# EAGLE design CFT-PB02 (EAGLE 5.11)
DRAWN_BY: Alexios; PROJECT_NAME: CFT Mini-Computer; REVISION: Rev F; SHEET_DESCRIPTION: Microcode Banking; SIMULATION_FILENAME: N/A; URL: http://www.bedroomlan.org/cft

## Sheet 1 of 4
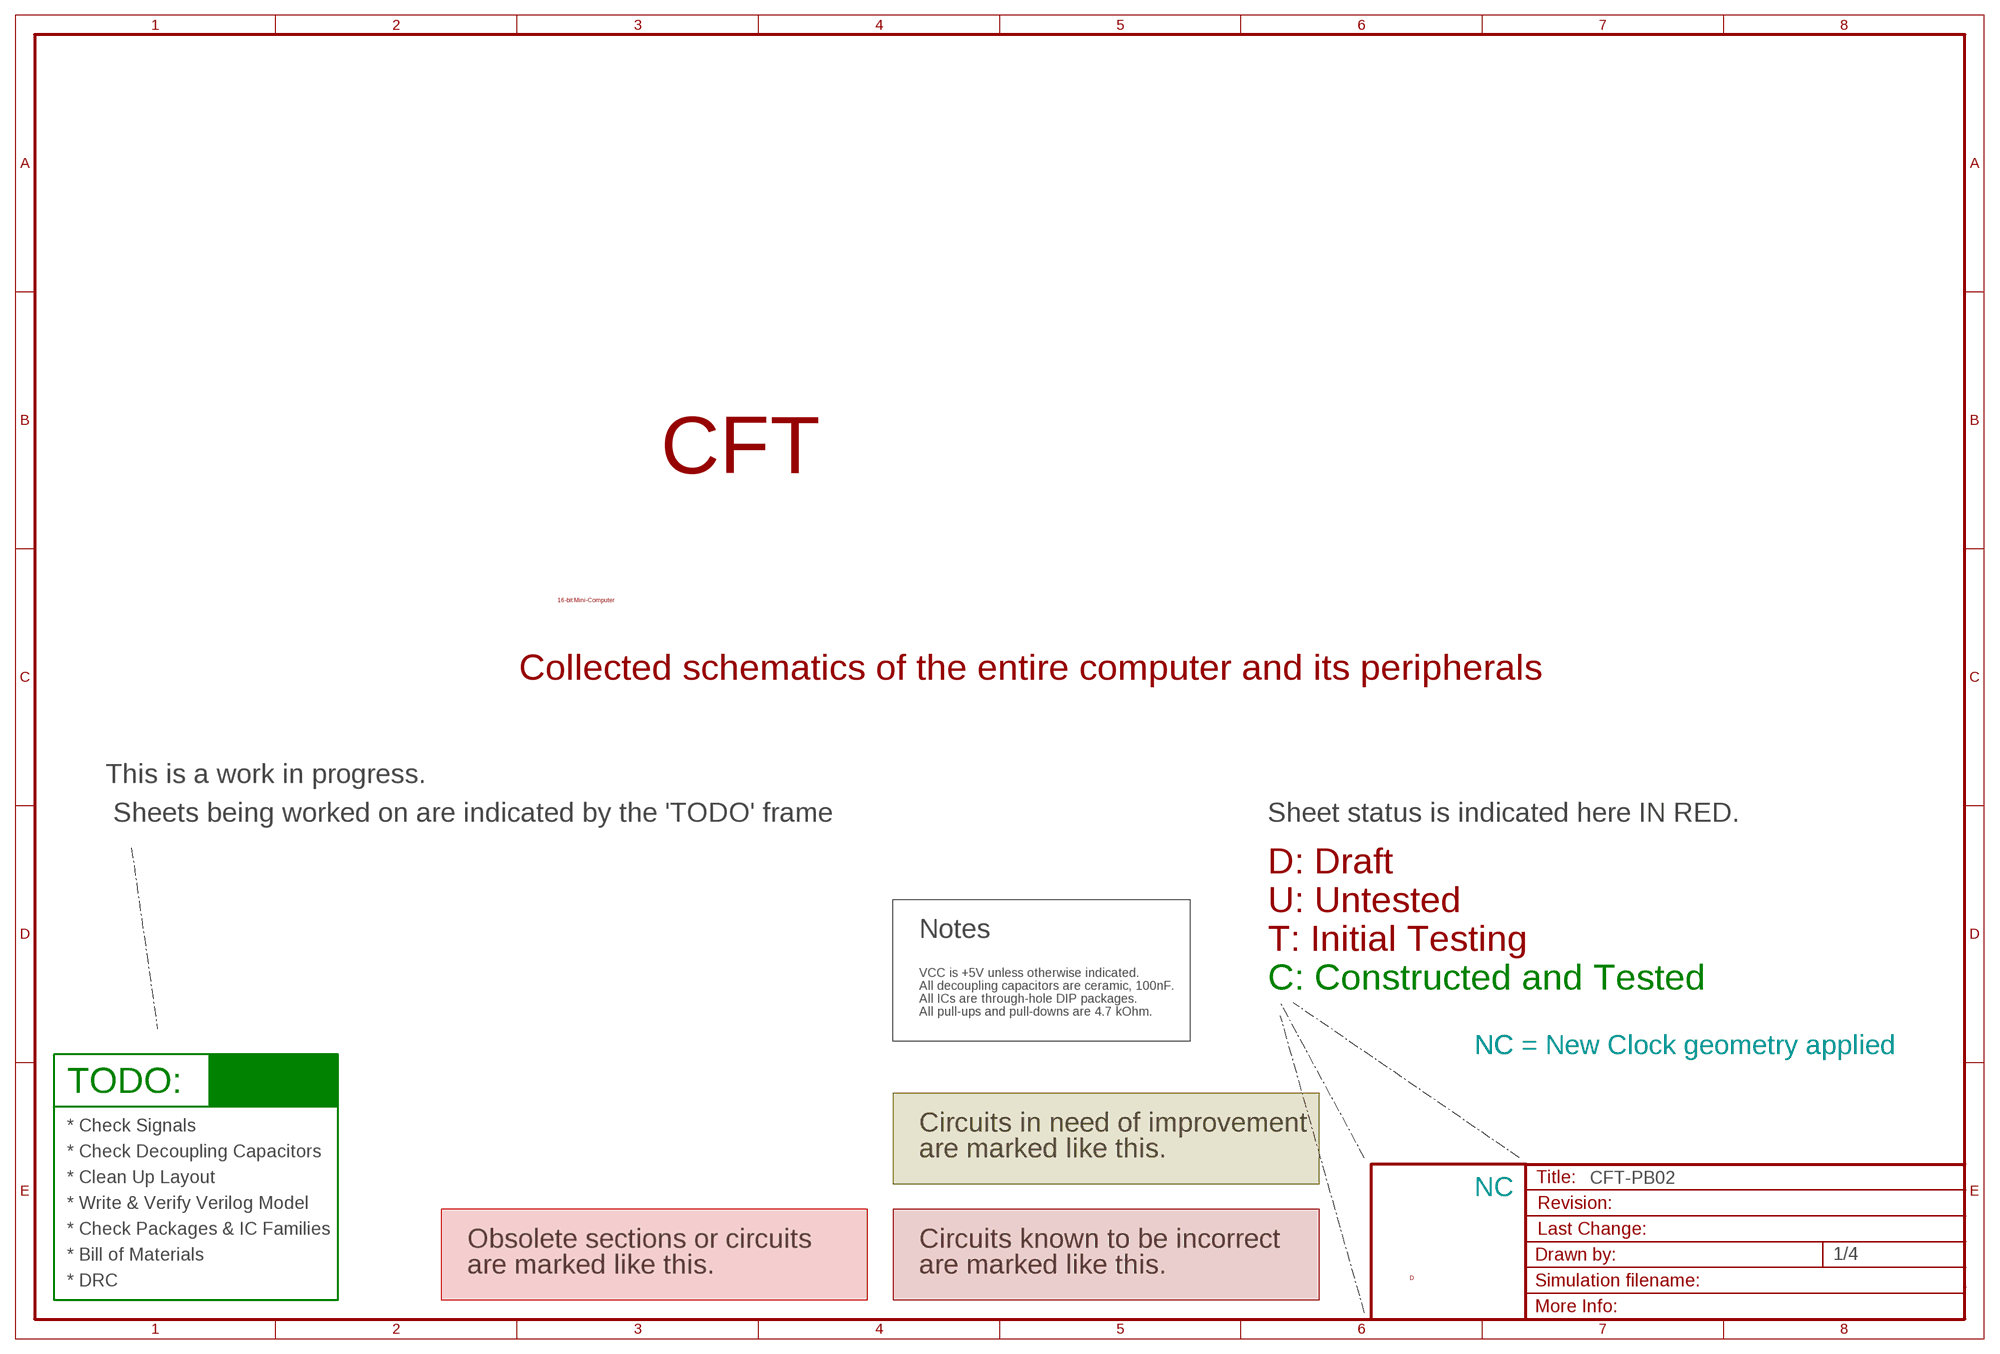
[diagram p0: schematic, sheet 1]

### Notes on the sheet
- CFT
- 16-bit Mini-Computer
- Collected schematics of the entire computer and its peripherals
- This is a work in progress.
- Sheets being worked on are indicated by the 'TODO' frame | Sheet status is indicated here IN RED.
- D: Draft
- U: Untested
- Notes
- T: Initial Testing
- VCC is +5V unless otherwise indicated.
- All decoupling capacitors are ceramic, 100nF. | C: Constructed and Tested
- All ICs are through-hole DIP packages.
- All pull-ups and pull-downs are 4.7 kOhm.
- NC | NC = New Clock geometry applied
- TODO:
- * Check Signals | Circuits in need of improvement
- * Check Decoupling Capacitors | are marked like this.
- * Clean Up Layout
- NC
- * Write & Verify Verilog Model
- * Check Packages & IC Families
- Obsolete sections or circuits | Circuits known to be incorrect
- * Bill of Materials
- are marked like this. | are marked like this.
- D
- * DRC

## Sheet 2 of 4
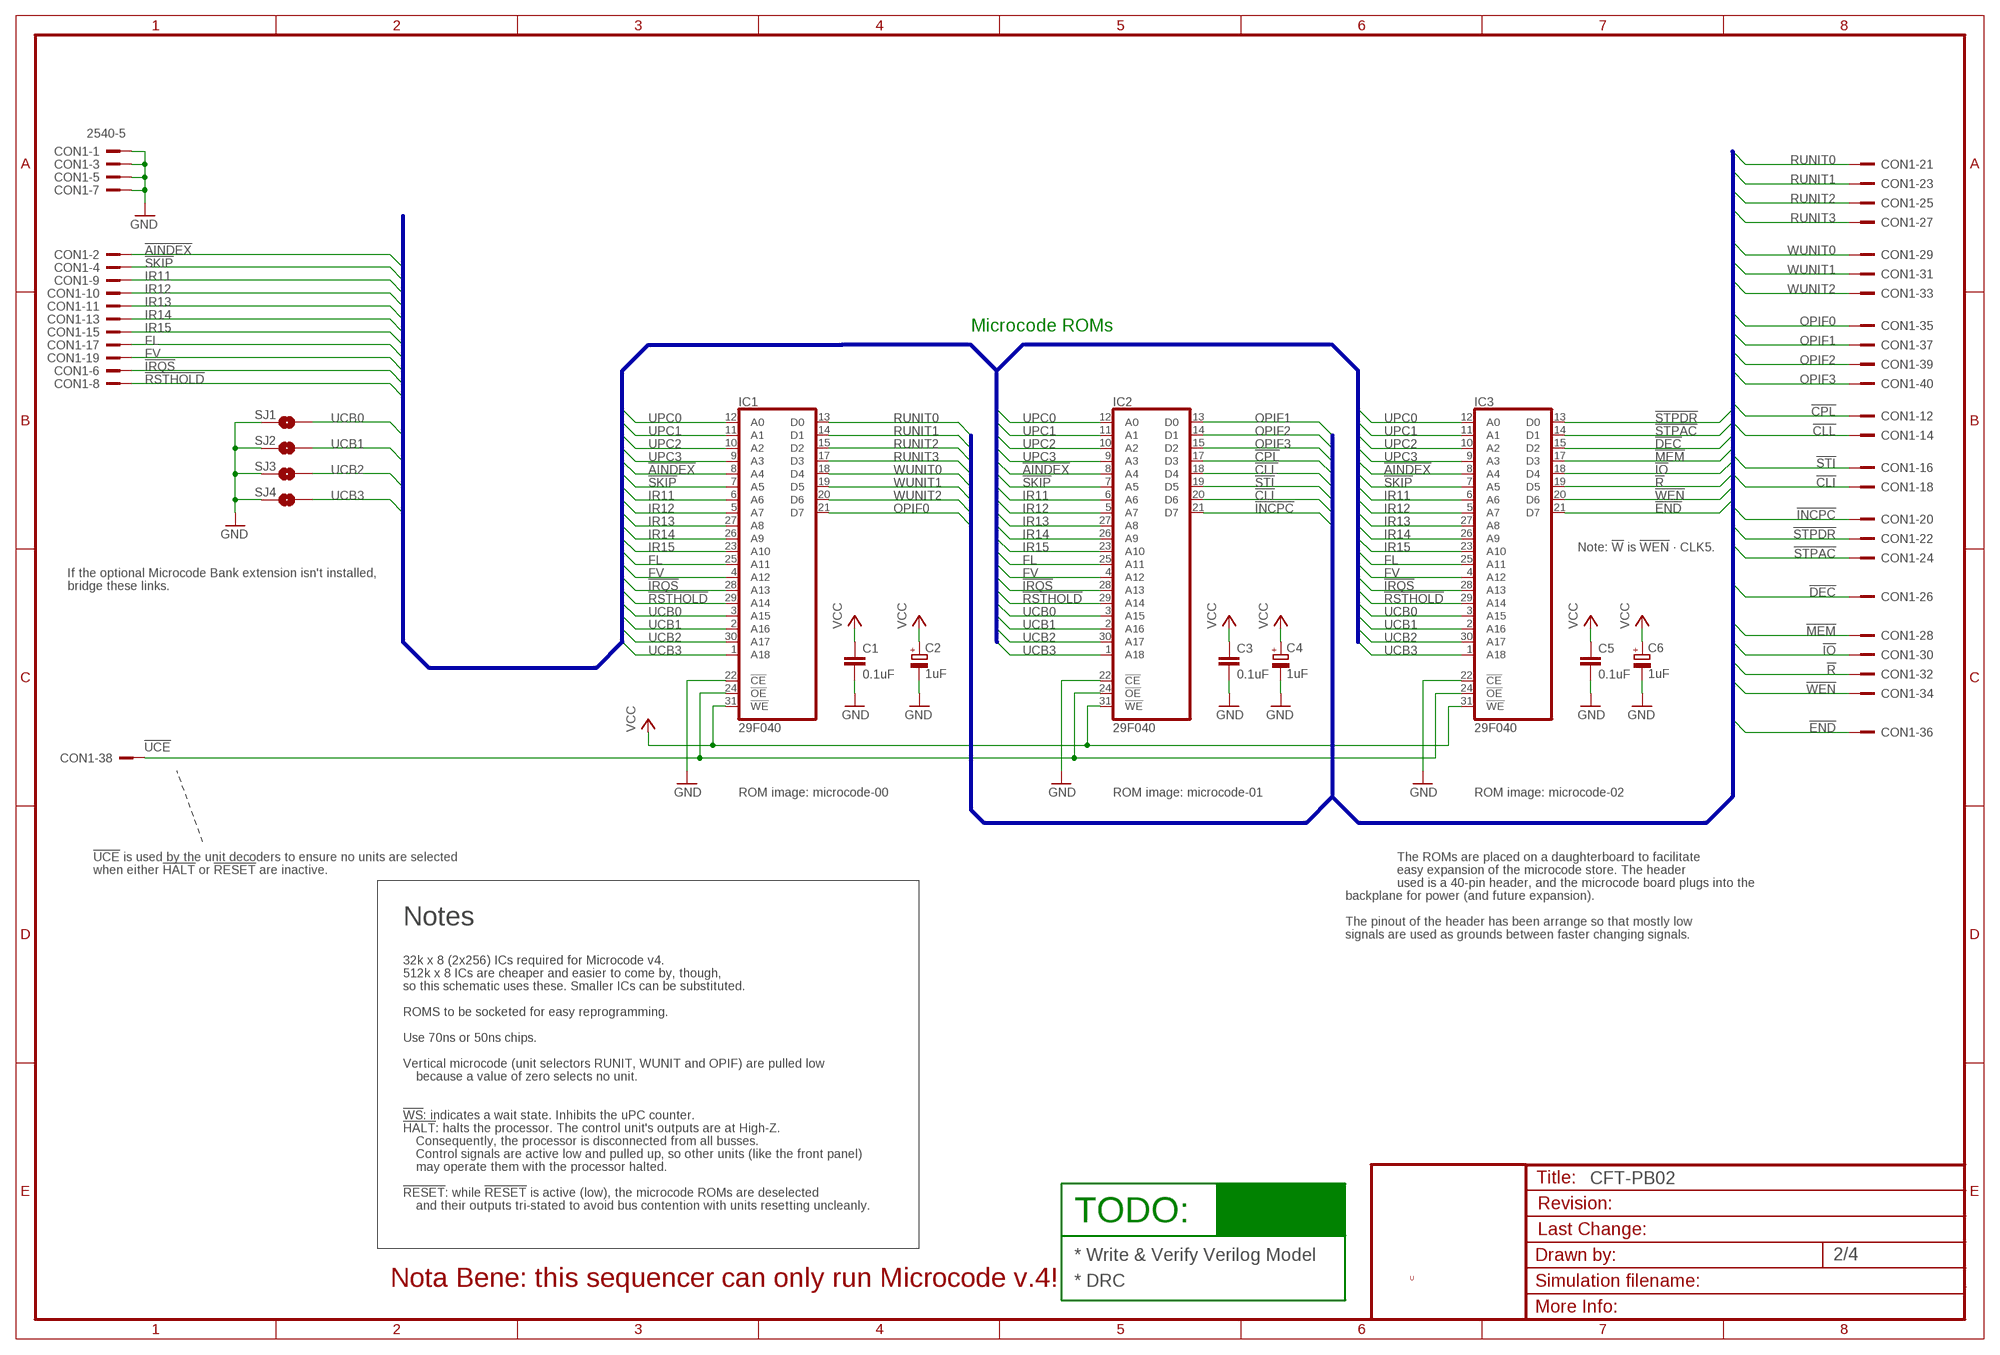
[diagram p1: schematic, sheet 2, part 1 of 2]
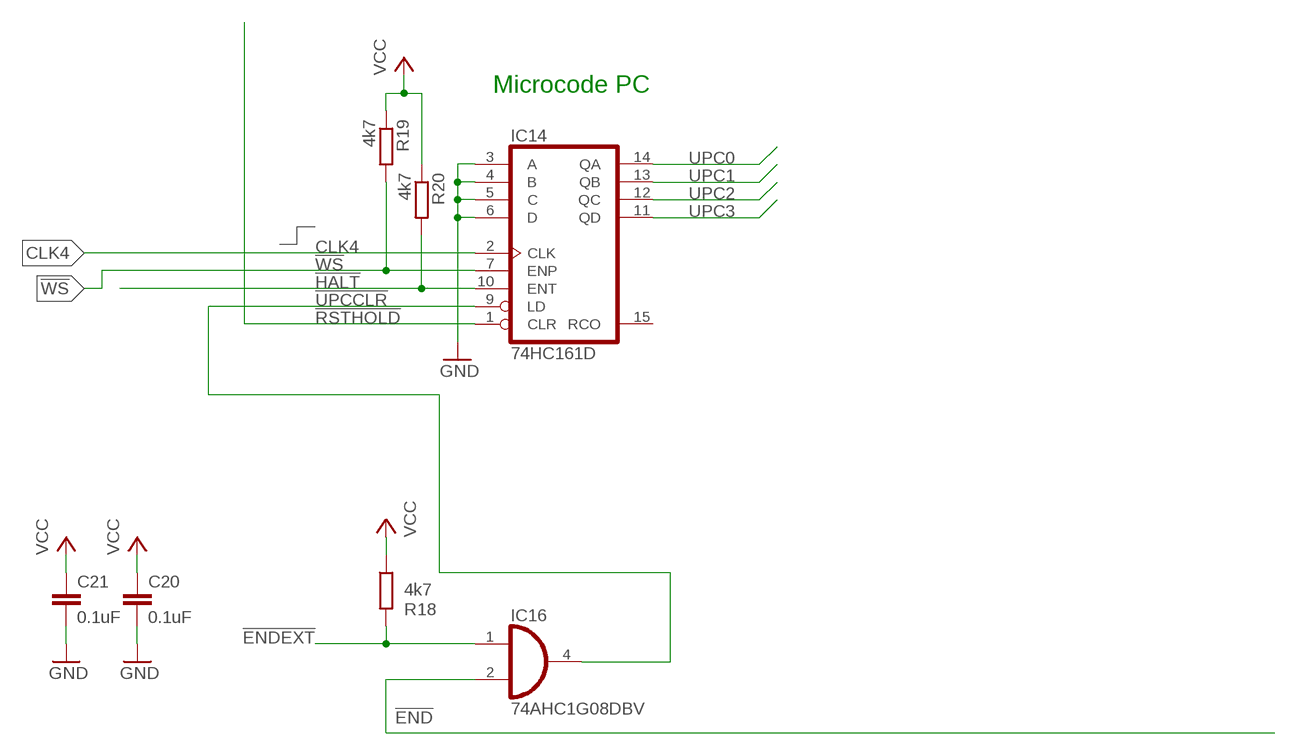
[diagram p2: schematic, sheet 2, part 2 of 2]

### Parts
C1  0.1uF  C-EUC0805K  [C0805K]
C2  1uF  CPOL-EUE2.5-5  [E2,5-5]
C3  0.1uF  C-EUC0805K  [C0805K]
C4  1uF  CPOL-EUE2.5-5  [E2,5-5]
C5  0.1uF  C-EUC0805K  [C0805K]
C6  1uF  CPOL-EUE2.5-5  [E2,5-5]
C20  0.1uF  C-EUC0805K  [C0805K]
C21  0.1uF  C-EUC0805K  [C0805K]
CON1  2540-5  [PAK100/2500-5-40]
IC1  29F040  29F040PLCC32  [PLCC32]
IC2  29F040  29F040PLCC32  [PLCC32]
IC3  29F040  29F040PLCC32  [PLCC32]
IC14  74HC161D  [SO16D]
IC16  74AHC1G08DBV  [SOT23-5]
R18  4k7  R-EU_R0805W  [R0805W]
R19  4k7  R-EU_R0805W  [R0805W]
R20  4k7  R-EU_R0805W  [R0805W]
SJ1  SOLDERJUMPER-OLDNO  [SJ_2S-NO]
SJ2  SOLDERJUMPER-OLDNO  [SJ_2S-NO]
SJ3  SOLDERJUMPER-OLDNO  [SJ_2S-NO]
SJ4  SOLDERJUMPER-OLDNO  [SJ_2S-NO]

### Nets
!AINDEX: CON1.2 IC1.8(A4) IC2.8(A4) IC3.8(A4)
!CLI: CON1.18 IC2.20(D6)
!CLL: CON1.14 IC2.18(D4)
!CPL: CON1.12 IC2.17(D3)
!DEC: CON1.26 IC3.15(D2)
!END: CON1.36 IC3.21(D7) IC16.2(I1) ; also sheet 3
!ENDEXT: IC16.1(I0) R18.2 ; also sheet 4
!HALT: IC14.10(ENT) R20.2 ; also sheet 4
!INCPC: CON1.20 IC2.21(D7)
!IO: CON1.30 IC3.18(D4) ; also sheet 4
!IRQS: CON1.6 IC1.28(A13) IC2.28(A13) IC3.28(A13) ; also sheet 4
!MEM: CON1.28 IC3.17(D3) ; also sheet 4
!R: CON1.32 IC3.19(D5) ; also sheet 4
!RSTHOLD: CON1.8 IC1.29(A14) IC2.29(A14) IC3.29(A14) IC14.1(CLR)
!SKIP: CON1.4 IC1.7(A5) IC2.7(A5) IC3.7(A5)
!STI: CON1.16 IC2.19(D5)
!STPAC: CON1.24 IC3.14(D1)
!STPDR: CON1.22 IC3.13(D0)
!UCE: CON1.38 IC1.24(!OE) IC2.24(!OE) IC3.24(!OE)
!UPCCLR: IC14.9(LD) IC16.4(O)
!WEN: CON1.34 IC3.20(D6)
!WS: IC14.7(ENP) R19.2 ; also sheet 4
CLK4: IC14.2(CLK) ; also sheet 4
FL: CON1.17 IC1.25(A11) IC2.25(A11) IC3.25(A11)
FV: CON1.19 IC1.4(A12) IC2.4(A12) IC3.4(A12)
GND [low power]: C1.2 C2.- C3.2 C4.- C5.2 C6.- C20.2 C21.2 CON1.1 CON1.3 CON1.5 CON1.7 IC1.22(!CE) IC2.22(!CE) IC3.22(!CE) IC14.3(A) IC14.4(B) IC14.5(C) IC14.6(D) SJ1.1 SJ2.1 SJ3.1 SJ4.1 ; also sheet 3,4
IR11: CON1.9 IC1.6(A6) IC2.6(A6) IC3.6(A6)
IR12: CON1.10 IC1.5(A7) IC2.5(A7) IC3.5(A7)
IR13: CON1.11 IC1.27(A8) IC2.27(A8) IC3.27(A8)
IR14: CON1.13 IC1.26(A9) IC2.26(A9) IC3.26(A9)
IR15: CON1.15 IC1.23(A10) IC2.23(A10) IC3.23(A10)
OPIF0: CON1.35 IC1.21(D7)
OPIF1: CON1.37 IC2.13(D0)
OPIF2: CON1.39 IC2.14(D1)
OPIF3: CON1.40 IC2.15(D2)
RUNIT0: CON1.21 IC1.13(D0)
RUNIT1: CON1.23 IC1.14(D1)
RUNIT2: CON1.25 IC1.15(D2)
RUNIT3: CON1.27 IC1.17(D3)
UCB0: IC1.3(A15) IC2.3(A15) IC3.3(A15) SJ1.2 ; also sheet 3
UCB1: IC1.2(A16) IC2.2(A16) IC3.2(A16) SJ2.2 ; also sheet 3
UCB2: IC1.30(A17) IC2.30(A17) IC3.30(A17) SJ3.2 ; also sheet 3
UCB3: IC1.1(A18) IC2.1(A18) IC3.1(A18) SJ4.2 ; also sheet 3
UPC0: IC1.12(A0) IC2.12(A0) IC3.12(A0) IC14.14(QA)
UPC1: IC1.11(A1) IC2.11(A1) IC3.11(A1) IC14.13(QB)
UPC2: IC1.10(A2) IC2.10(A2) IC3.10(A2) IC14.12(QC)
UPC3: IC1.9(A3) IC2.9(A3) IC3.9(A3) IC14.11(QD)
VCC [low power]: C1.1 C2.+ C3.1 C4.+ C5.1 C6.+ C20.1 C21.1 IC1.31(!WE) IC2.31(!WE) IC3.31(!WE) R18.1 R19.1 R20.1 ; also sheet 3,4
WUNIT0: CON1.29 IC1.18(D4)
WUNIT1: CON1.31 IC1.19(D5)
WUNIT2: CON1.33 IC1.20(D6)
Unconnected: IC14.15(RCO)

### Buses
MCINSTR:RUNIT[0..3],WUNIT[0..2],OPIF[0..3],!CPL,!CLL,!STI,!CLI,!INCPC,!STPDR,!STPAC,!DEC,!MEM,!IO,!R,!W,!END
MCADDR:UPC[0..3],!AINDEX,!SKIP,IR[11..15],FL,FV,!IRQS,!RSTHOLD
MCADDR:UPC[0..3],!AINDEX,!SKIP,IR[11..15],FL,FV,!IRQS,!RSTHOLD,UCB[0..3]

### Notes on the sheet
- Microcode ROMs
- Microcode PC
- Note: !W! is !WEN! · CLK5.
- If the optional Microcode Bank extension isn't installed,
- bridge these links.
- ROM image: microcode-00 | ROM image: microcode-01 | ROM image: microcode-02
- !UCE! is used by the unit decoders to ensure no units are selected | The ROMs are placed on a daughterboard to facilitate
- when either !HALT! or !RESET! are inactive. | easy expansion of the microcode store. The header
- used is a 40-pin header, and the microcode board plugs into the
- backplane for power (and future expansion).
- Notes | The pinout of the header has been arrange so that mostly low
- signals are used as grounds between faster changing signals.
- 32k x 8 (2x256) ICs required for Microcode v4.
- 512k x 8 ICs are cheaper and easier to come by, though,
- so this schematic uses these. Smaller ICs can be substituted.
- ROMS to be socketed for easy reprogramming.
- Use 70ns or 50ns chips.
- Vertical microcode (unit selectors RUNIT, WUNIT and OPIF) are pulled low
- because a value of zero selects no unit.
- !WS!: indicates a wait state. Inhibits the uPC counter.
- !HALT!: halts the processor. The control unit's outputs are at High-Z.
- Consequently, the processor is disconnected from all busses.
- Control signals are active low and pulled up, so other units (like the front panel)
- may operate them with the processor halted.
- !RESET!: while !RESET! is active (low), the microcode ROMs are deselected
- and their outputs tri-stated to avoid bus contention with units resetting uncleanly.
- TODO:
- * Write & Verify Verilog Model
- U
- Nota Bene: this sequencer can only run Microcode v.4! | * DRC

## Sheet 3 of 4
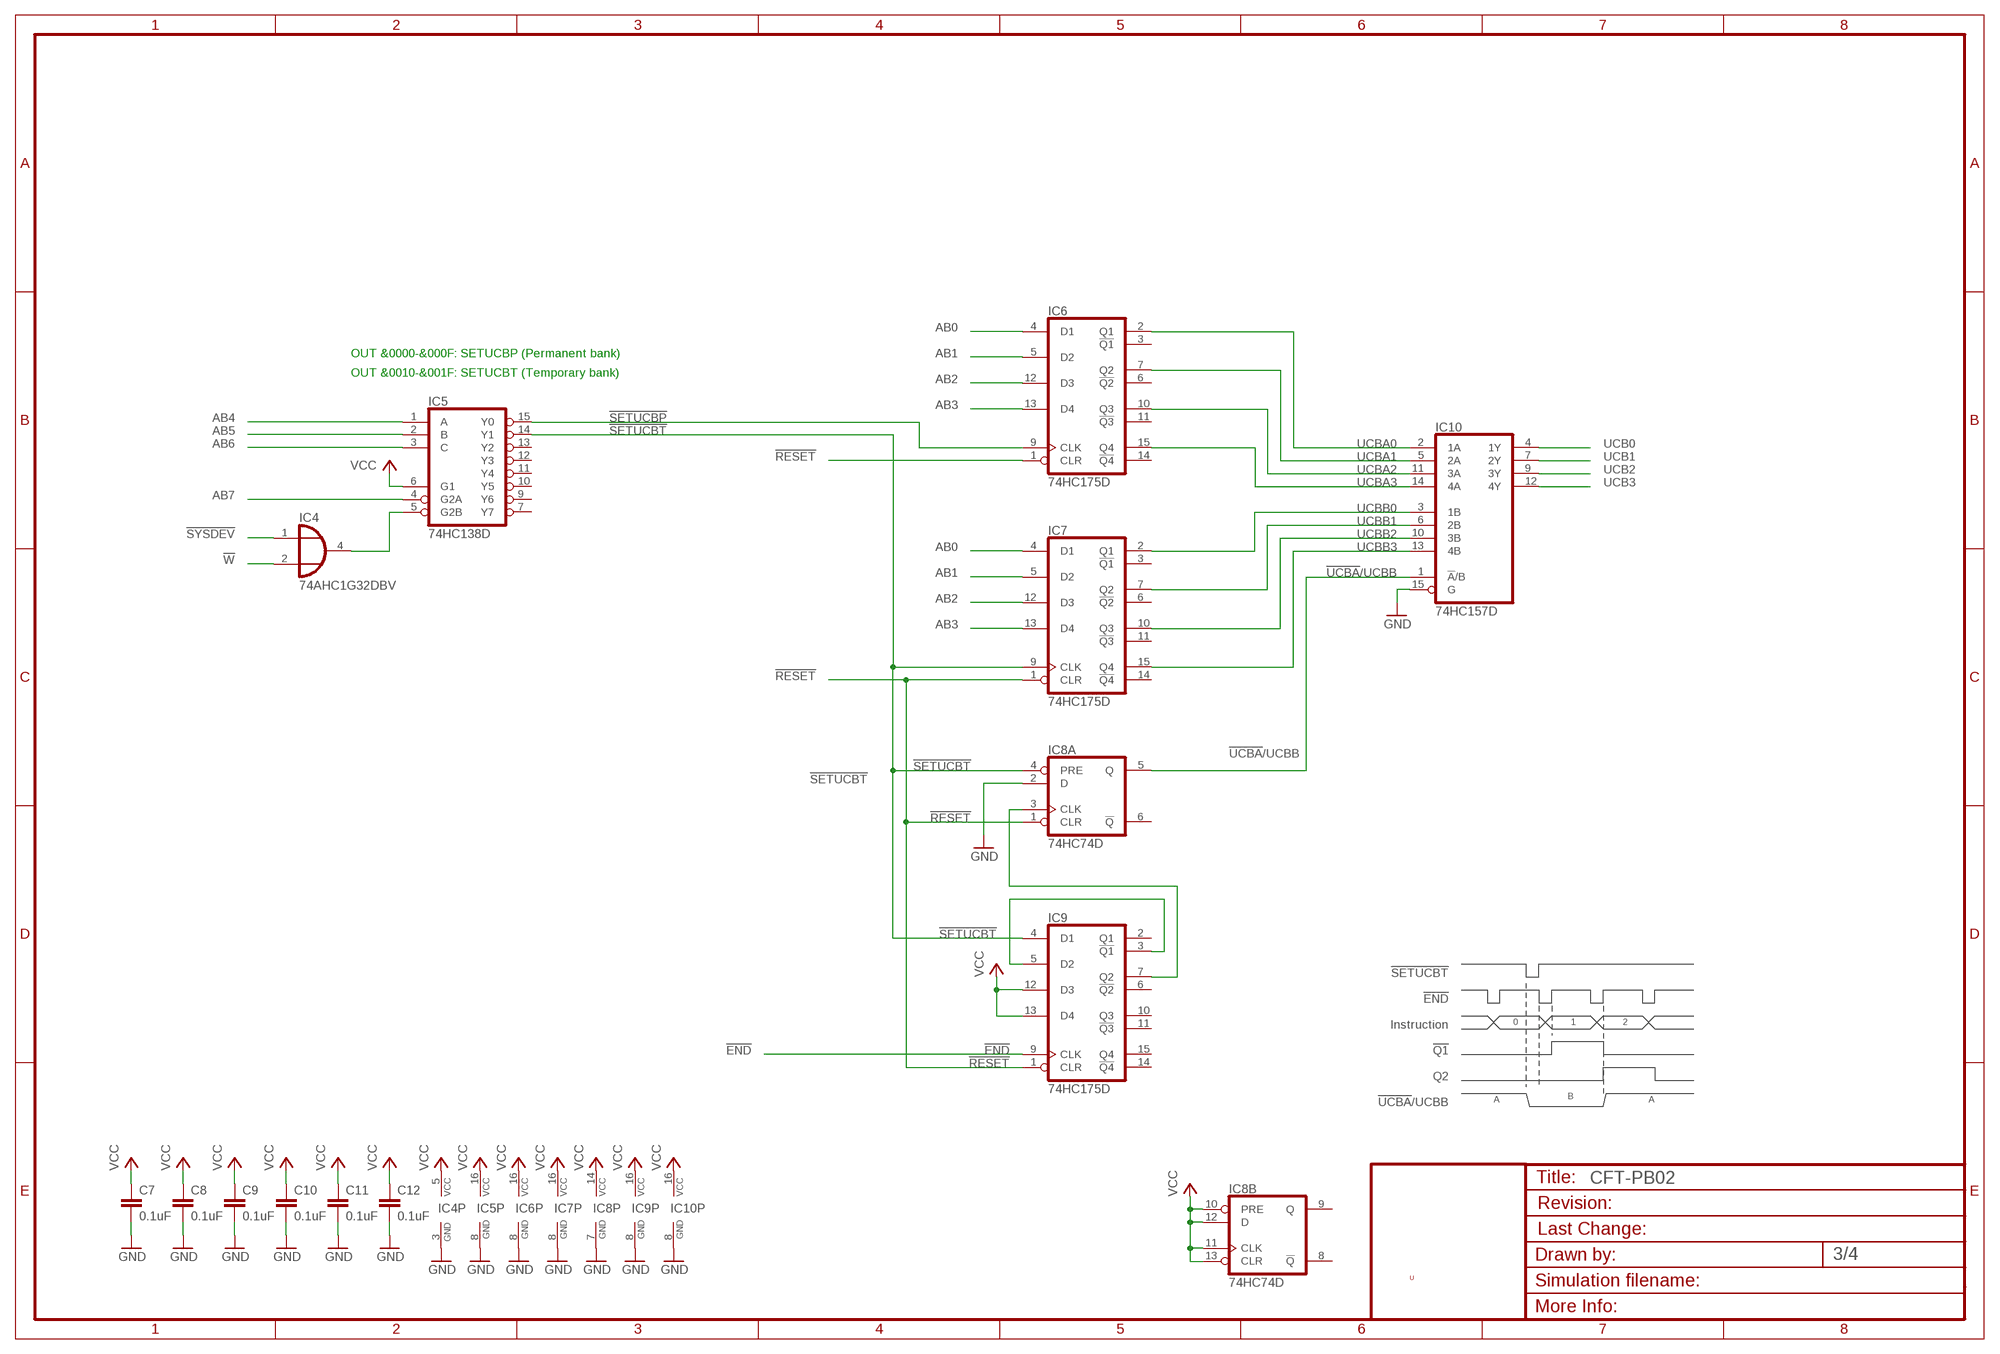
[diagram p3: schematic, sheet 3]

### Parts
C7  0.1uF  C-EUC0805K  [C0805K]
C8  0.1uF  C-EUC0805K  [C0805K]
C9  0.1uF  C-EUC0805K  [C0805K]
C10  0.1uF  C-EUC0805K  [C0805K]
C11  0.1uF  C-EUC0805K  [C0805K]
C12  0.1uF  C-EUC0805K  [C0805K]
IC4  74AHC1G32DBV  [SOT23-5]
IC5  74HC138D  [SO16]
IC6  74HC175D  [SO16]
IC7  74HC175D  [SO16]
IC8  74HC74D  [SO14]
IC9  74HC175D  [SO16]
IC10  74HC157D  74HC157/ALT-D  [SO16]

### Nets
!END: IC9.9(CLK) ; also sheet 2
!RESET: IC6.1(CLR) IC7.1(CLR) IC8.1(A:CLR) IC9.1(CLR) ; also sheet 4
!SETUCBP: IC5.15(Y0) IC6.9(CLK)
!SETUCBT: IC5.14(Y1) IC7.9(CLK) IC8.4(A:PRE) IC9.4(D1)
!SYSDEV: IC4.1(I0) ; also sheet 4
!UCBA!/UCBB: IC8.5(A:Q) IC10.1(!A!/B)
!W: IC4.2(I1) ; also sheet 4
AB0: IC6.4(D1) IC7.4(D1) ; also sheet 4
AB1: IC6.5(D2) IC7.5(D2) ; also sheet 4
AB2: IC6.12(D3) IC7.12(D3) ; also sheet 4
AB3: IC6.13(D4) IC7.13(D4) ; also sheet 4
AB4: IC5.1(A) ; also sheet 4
AB5: IC5.2(B) ; also sheet 4
AB6: IC5.3(C) ; also sheet 4
AB7: IC5.4(G2A) ; also sheet 4
GND [low power]: C7.2 C8.2 C9.2 C10.2 C11.2 C12.2 IC4.3(GND) IC5.8(GND) IC6.8(GND) IC7.8(GND) IC8.2(A:D) IC8.7(P:GND) IC9.8(GND) IC10.8(GND) IC10.15(G) ; also sheet 2,4
N$11: IC4.4(O) IC5.5(G2B)
N$12: IC9.3(!Q1) IC9.5(D2)
N$13: IC8.3(A:CLK) IC9.7(Q2)
UCB0: IC10.4(1Y) ; also sheet 2
UCB1: IC10.7(2Y) ; also sheet 2
UCB2: IC10.9(3Y) ; also sheet 2
UCB3: IC10.12(4Y) ; also sheet 2
UCBA0: IC6.2(Q1) IC10.2(1A)
UCBA1: IC6.7(Q2) IC10.5(2A)
UCBA2: IC6.10(Q3) IC10.11(3A)
UCBA3: IC6.15(Q4) IC10.14(4A)
UCBB0: IC7.2(Q1) IC10.3(1B)
UCBB1: IC7.7(Q2) IC10.6(2B)
UCBB2: IC7.10(Q3) IC10.10(3B)
UCBB3: IC7.15(Q4) IC10.13(4B)
VCC [low power]: C7.1 C8.1 C9.1 C10.1 C11.1 C12.1 IC4.5(VCC) IC5.6(G1) IC5.16(VCC) IC6.16(VCC) IC7.16(VCC) IC8.10(B:PRE) IC8.11(B:CLK) IC8.12(B:D) IC8.13(B:CLR) IC8.14(P:VCC) IC9.12(D3) IC9.13(D4) IC9.16(VCC) IC10.16(VCC) ; also sheet 2,4
Unconnected: IC5.7(Y7) IC5.9(Y6) IC5.10(Y5) IC5.11(Y4) IC5.12(Y3) IC5.13(Y2) IC6.3(!Q1) IC6.6(!Q2) IC6.11(!Q3) IC6.14(!Q4) IC7.3(!Q1) IC7.6(!Q2) IC7.11(!Q3) IC7.14(!Q4) IC8.6(A:!Q) IC8.8(B:!Q) IC8.9(B:Q) IC9.2(Q1) IC9.6(!Q2) IC9.10(Q3) IC9.11(!Q3) IC9.14(!Q4) IC9.15(Q4)

### Notes on the sheet
- OUT &0000-&000F: SETUCBP (Permanent bank)
- OUT &0010-&001F: SETUCBT (Temporary bank)
- !SETUCBT
- !END
- 0 | 1 | 2
- Instruction
- !Q1
- Q2
- B
- A | A
- !UCBA!/UCBB
- U

## Sheet 4 of 4
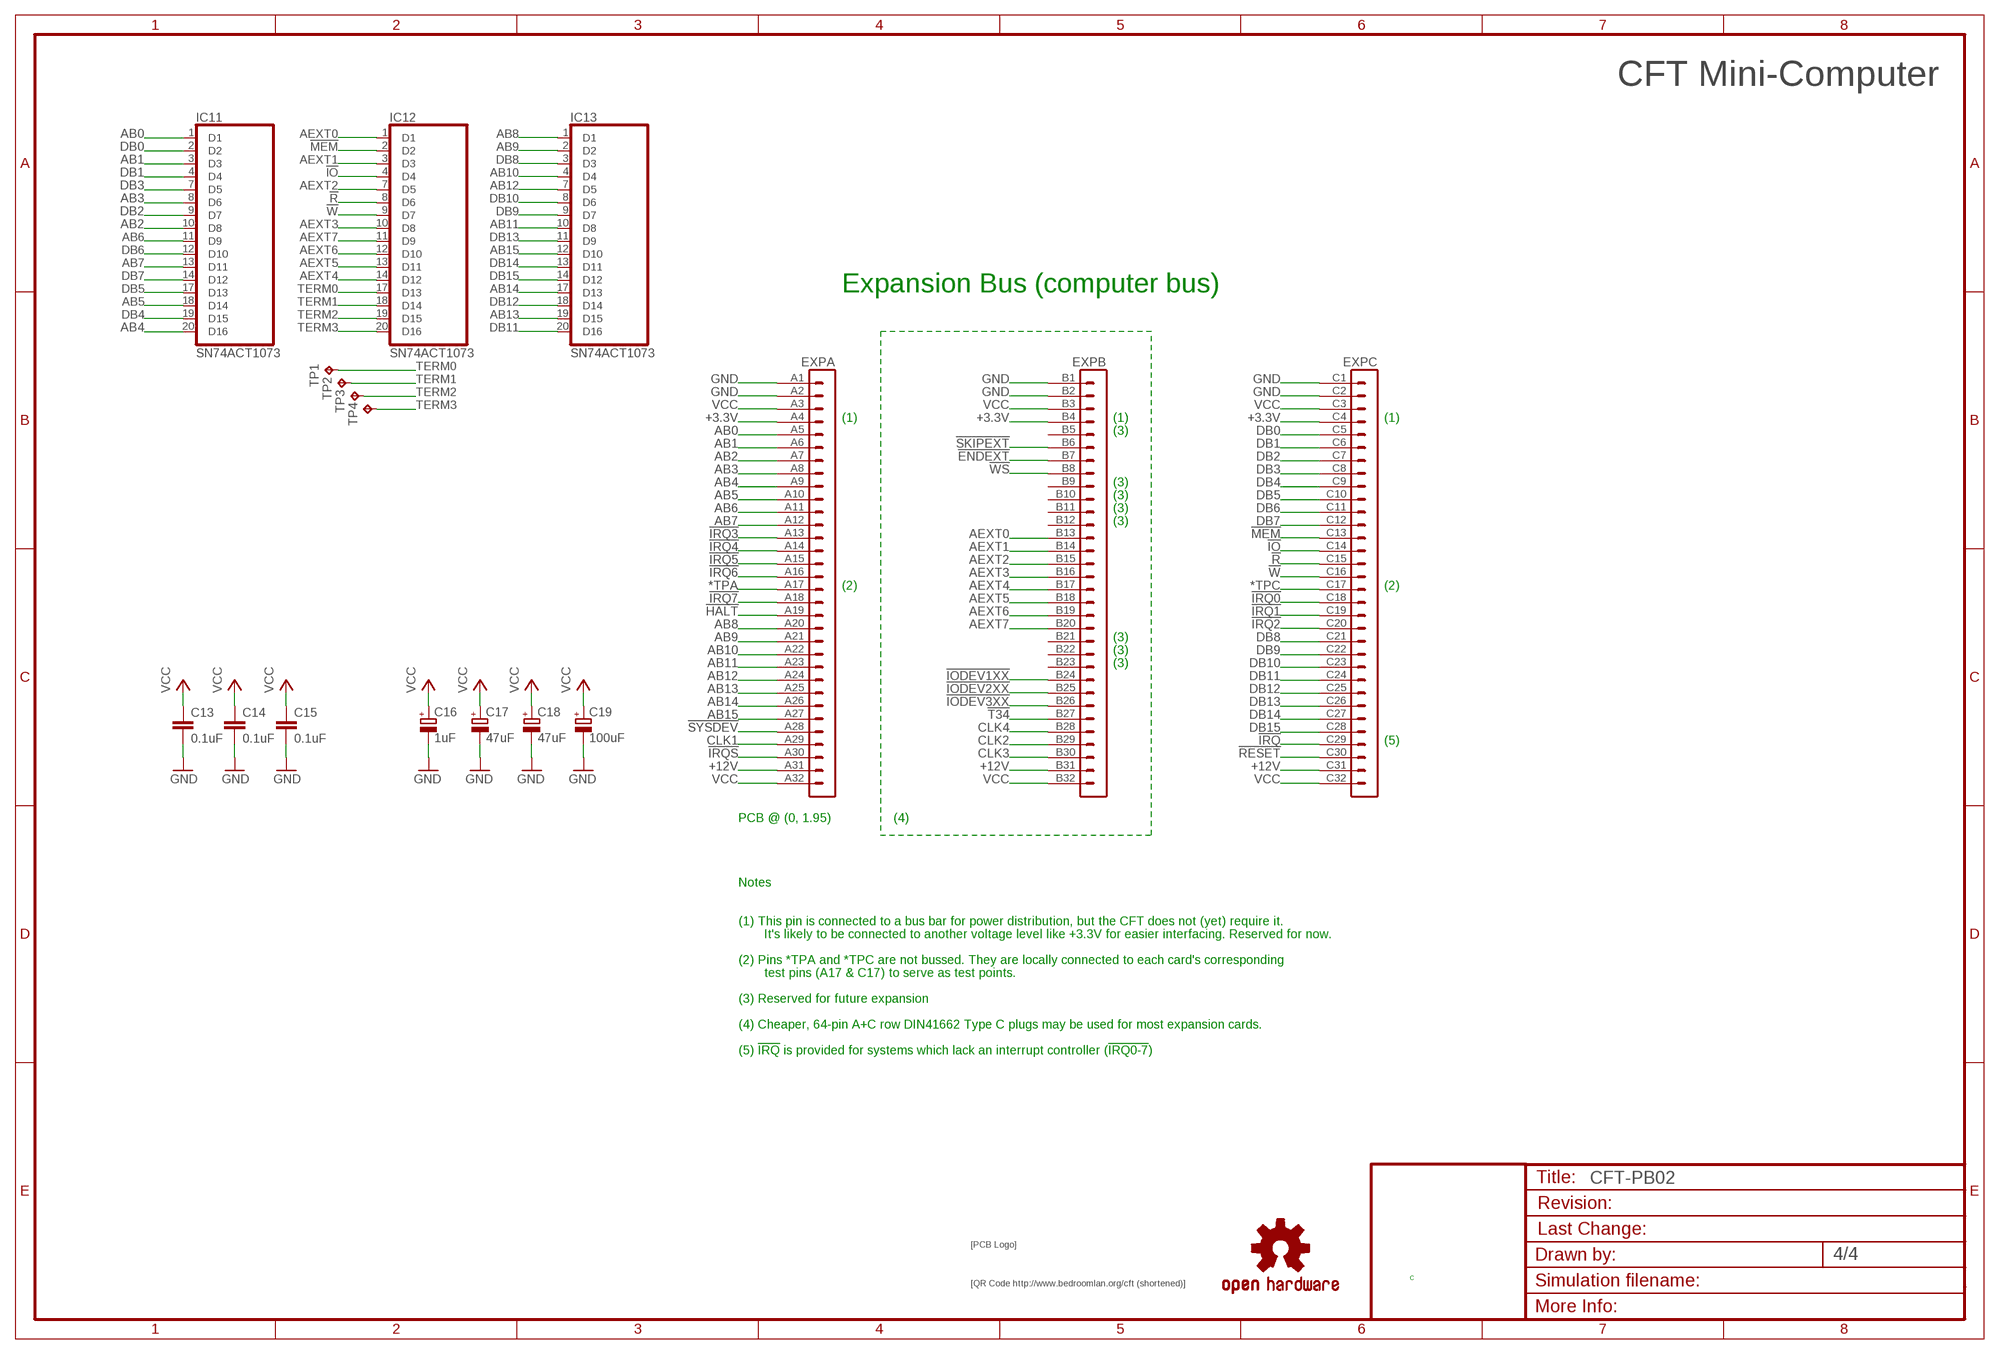
[diagram p4: schematic, sheet 4]

### Parts
$4_37_$  SIGNATURESILK  [SIGNATURE]
$4_39_$  OSHW-LOGOL  [OSHW-LOGO-L]
C13  0.1uF  C-EUC0805K  [C0805K]
C14  0.1uF  C-EUC0805K  [C0805K]
C15  0.1uF  C-EUC0805K  [C0805K]
C16  1uF  CPOL-EUE2.5-5  [E2,5-5]
C17  47uF  CPOL-EUE2.5-5  [E2,5-5]
C18  47uF  CPOL-EUE2.5-5  [E2,5-5]
C19  100uF  CPOL-EUE2.5-7  [E2,5-7]
EXP  VG96-3K  [VG96K]
IC11  SN74ACT1073  [SO20W]
IC12  SN74ACT1073  [SO20W]
IC13  SN74ACT1073  [SO20W]
TP1  TPPAD1-13  [P1-13]
TP2  TPPAD1-13  [P1-13]
TP3  TPPAD1-13  [P1-13]
TP4  TPPAD1-13  [P1-13]
U$2  QRCODE-CFT  [CFT-QRCODE]

### Nets
!ENDEXT: EXP.B7 ; also sheet 2
!HALT: EXP.A19 ; also sheet 2
!IO: EXP.C14 IC12.4(D4) ; also sheet 2
!IODEV1XX: EXP.B24
!IODEV2XX: EXP.B25
!IODEV3XX: EXP.B26
!IRQ: EXP.C29
!IRQ0: EXP.C18
!IRQ1: EXP.C19
!IRQ2: EXP.C20
!IRQ3: EXP.A13
!IRQ4: EXP.A14
!IRQ5: EXP.A15
!IRQ6: EXP.A16
!IRQ7: EXP.A18
!IRQS: EXP.A30 ; also sheet 2
!MEM: EXP.C13 IC12.2(D2) ; also sheet 2
!R: EXP.C15 IC12.8(D6) ; also sheet 2
!RESET: EXP.C30 ; also sheet 3
!SKIPEXT: EXP.B6
!SYSDEV: EXP.A28 ; also sheet 3
!T34: EXP.B27
!W: EXP.C16 IC12.9(D7) ; also sheet 3
!WS: EXP.B8 ; also sheet 2
*TPA: EXP.A17
*TPC: EXP.C17
+3.3V: EXP.A4 EXP.B4 EXP.C4
+12V [LED power]: EXP.A31 EXP.B31 EXP.C31
AB0: EXP.A5 IC11.1(D1) ; also sheet 3
AB1: EXP.A6 IC11.3(D3) ; also sheet 3
AB2: EXP.A7 IC11.10(D8) ; also sheet 3
AB3: EXP.A8 IC11.8(D6) ; also sheet 3
AB4: EXP.A9 IC11.20(D16) ; also sheet 3
AB5: EXP.A10 IC11.18(D14) ; also sheet 3
AB6: EXP.A11 IC11.11(D9) ; also sheet 3
AB7: EXP.A12 IC11.13(D11) ; also sheet 3
AB8: EXP.A20 IC13.1(D1)
AB9: EXP.A21 IC13.2(D2)
AB10: EXP.A22 IC13.4(D4)
AB11: EXP.A23 IC13.10(D8)
AB12: EXP.A24 IC13.7(D5)
AB13: EXP.A25 IC13.19(D15)
AB14: EXP.A26 IC13.17(D13)
AB15: EXP.A27 IC13.12(D10)
AEXT0: EXP.B13 IC12.1(D1)
AEXT1: EXP.B14 IC12.3(D3)
AEXT2: EXP.B15 IC12.7(D5)
AEXT3: EXP.B16 IC12.10(D8)
AEXT4: EXP.B17 IC12.14(D12)
AEXT5: EXP.B18 IC12.13(D11)
AEXT6: EXP.B19 IC12.12(D10)
AEXT7: EXP.B20 IC12.11(D9)
CLK1: EXP.A29
CLK2: EXP.B29
CLK3: EXP.B30
CLK4: EXP.B28 ; also sheet 2
DB0: EXP.C5 IC11.2(D2)
DB1: EXP.C6 IC11.4(D4)
DB2: EXP.C7 IC11.9(D7)
DB3: EXP.C8 IC11.7(D5)
DB4: EXP.C9 IC11.19(D15)
DB5: EXP.C10 IC11.17(D13)
DB6: EXP.C11 IC11.12(D10)
DB7: EXP.C12 IC11.14(D12)
DB8: EXP.C21 IC13.3(D3)
DB9: EXP.C22 IC13.9(D7)
DB10: EXP.C23 IC13.8(D6)
DB11: EXP.C24 IC13.20(D16)
DB12: EXP.C25 IC13.18(D14)
DB13: EXP.C26 IC13.11(D9)
DB14: EXP.C27 IC13.13(D11)
DB15: EXP.C28 IC13.14(D12)
GND [low power]: C13.2 C14.2 C15.2 C16.- C17.- C18.- C19.- EXP.A1 EXP.A2 EXP.B1 EXP.B2 EXP.C1 EXP.C2 ; also sheet 2,3
TERM0: IC12.17(D13) TP1.TP
TERM1: IC12.18(D14) TP2.TP
TERM2: IC12.19(D15) TP3.TP
TERM3: IC12.20(D16) TP4.TP
VCC [low power]: C13.1 C14.1 C15.1 C16.+ C17.+ C18.+ C19.+ EXP.A3 EXP.A32 EXP.B3 EXP.B32 EXP.C3 EXP.C32 ; also sheet 2,3
Unconnected: EXP.B5 EXP.B9 EXP.B10 EXP.B11 EXP.B12 EXP.B21 EXP.B22 EXP.B23

### Notes on the sheet
- CFT Mini-Computer
- Expansion Bus (computer bus)
- (1) | (1) | (1)
- (3)
- (3)
- (3)
- (3)
- (3)
- (2) | (2)
- (3)
- (3)
- (3)
- (5)
- PCB @ (0, 1.95) | (4)
- Notes
- (1) This pin is connected to a bus bar for power distribution, but the CFT does not (yet) require it.
- It's likely to be connected to another voltage level like +3.3V for easier interfacing. Reserved for now.
- (2) Pins *TPA and *TPC are not bussed. They are locally connected to each card's corresponding
- test pins (A17 & C17) to serve as test points.
- (3) Reserved for future expansion
- (4) Cheaper, 64-pin A+C row DIN41662 Type C plugs may be used for most expansion cards.
- (5) !IRQ! is provided for systems which lack an interrupt controller (!IRQ0-7!)
- C

## Power pins joined to a net without a drawn wire
GND: IC1.16(GND) IC2.16(GND) IC3.16(GND) IC11.5(GND) IC11.6(GND) IC12.5(GND) IC12.6(GND) IC13.5(GND) IC13.6(GND) IC14.8(GND) IC16.3(GND)
VCC: IC1.32(VCC) IC2.32(VCC) IC3.32(VCC) IC11.15(VCC) IC11.16(VCC) IC12.15(VCC) IC12.16(VCC) IC13.15(VCC) IC13.16(VCC) IC14.16(VCC) IC16.5(VCC)

## Library data of the parts
$4_37_$ = alexios:SIGNATURE: Soup signature
$4_39_$ = SparkFun:OSHW-LOGO: Open Source Hardware Logo This logo indicates the piece of hardware it is found on incorporates a OSHW license and/or adheres to the definition of open source hardware found here: http://freedomdefined.org/OSHW
C1 C3 C5 C7-C15 C20 C21 = rcl:C-EU: CAPACITOR, European symbol
C2 C4 C6 C16-C19 = rcl:CPOL-EU: POLARIZED CAPACITOR, European symbol
CON1 = con-3m:2540-: 3M (TM) Pak 100 4-Wall Header Source: 3M; OC_FARNELL: 9838414; OC_NEWARK: unknown
EXP = alexios-19inch:VG96-3: PCB EUROCARD, 96-pin type C/ABC, 2.54 mm
IC1-IC3 = alexios:29F040: 4-mbit (512x8) Flash memory in a PLCC32 package (with socket). AM29F040 is an example of this.
IC4 = alexios:74*1G32: 2-input OR gate
IC5 = alexios:74*138: 3-line to 8-line DECODER/DEMULTIPLEXER
IC6 IC7 IC9 = alexios:74*175: Qadruple D type FLIP FLOP, clear
IC8 = alexios:74*74: Dual D type positive edge triggered FLIP FLOP, preset and clear
IC10 = alexios:74*157/ALT-: Quadruple 2-line to 1-line data SELECTOR/MULTIPLEXER
IC11-IC13 = alexios:SN74ACT1073: SN74ACT1073 16-Bit Bus-Termination Array with Bus-Hold Function Datasheet <http://www.ti.com/lit/ds/symlink/sn74act1073.pdf>
IC14 = alexios:74*161: 4-Bit Synchronous Binary Counter. 4-bit synchronous binary counter with asynchronous reset. The ?AC163 devices are 4-bit binary counters. These synchronous, presettable counters feature an internal carry look-ahead for application in high-speed counting designs. Synchronous operation is provided by having all flip-flops clocked simultaneously so that the outputs change, coincident with each other, when instructed by the count-enable (ENP, ENT) inputs and internal gating.
IC16 = alexios:74*1G08: 2-input AND gate
R18 = rcl:R-EU_: RESISTOR, European symbol
R19 R20 = resistor:R-EU_: RESISTOR, European symbol
SJ1-SJ4 = SparkFun:SOLDERJUMPER-OLD: Solder Jumper Standard SMD solder jumper. Used to automate production. Two varients : Normally Open and Normally Closed are the same, but have different paste layers. NC will have a large amount of paste and should jumper during reflow.
TP1-TP4 = testpad:TP: Test pad
U$2 = alexios:QRCODE-*: Various QR codes in silkscreen.

## Net classes
0 default: width 0.305 mm, clearance 0.203 mm
1 low power: width 1.27 mm, clearance 0.254 mm
2 LED power: width 1.93 mm, clearance 0.254 mm

## Board
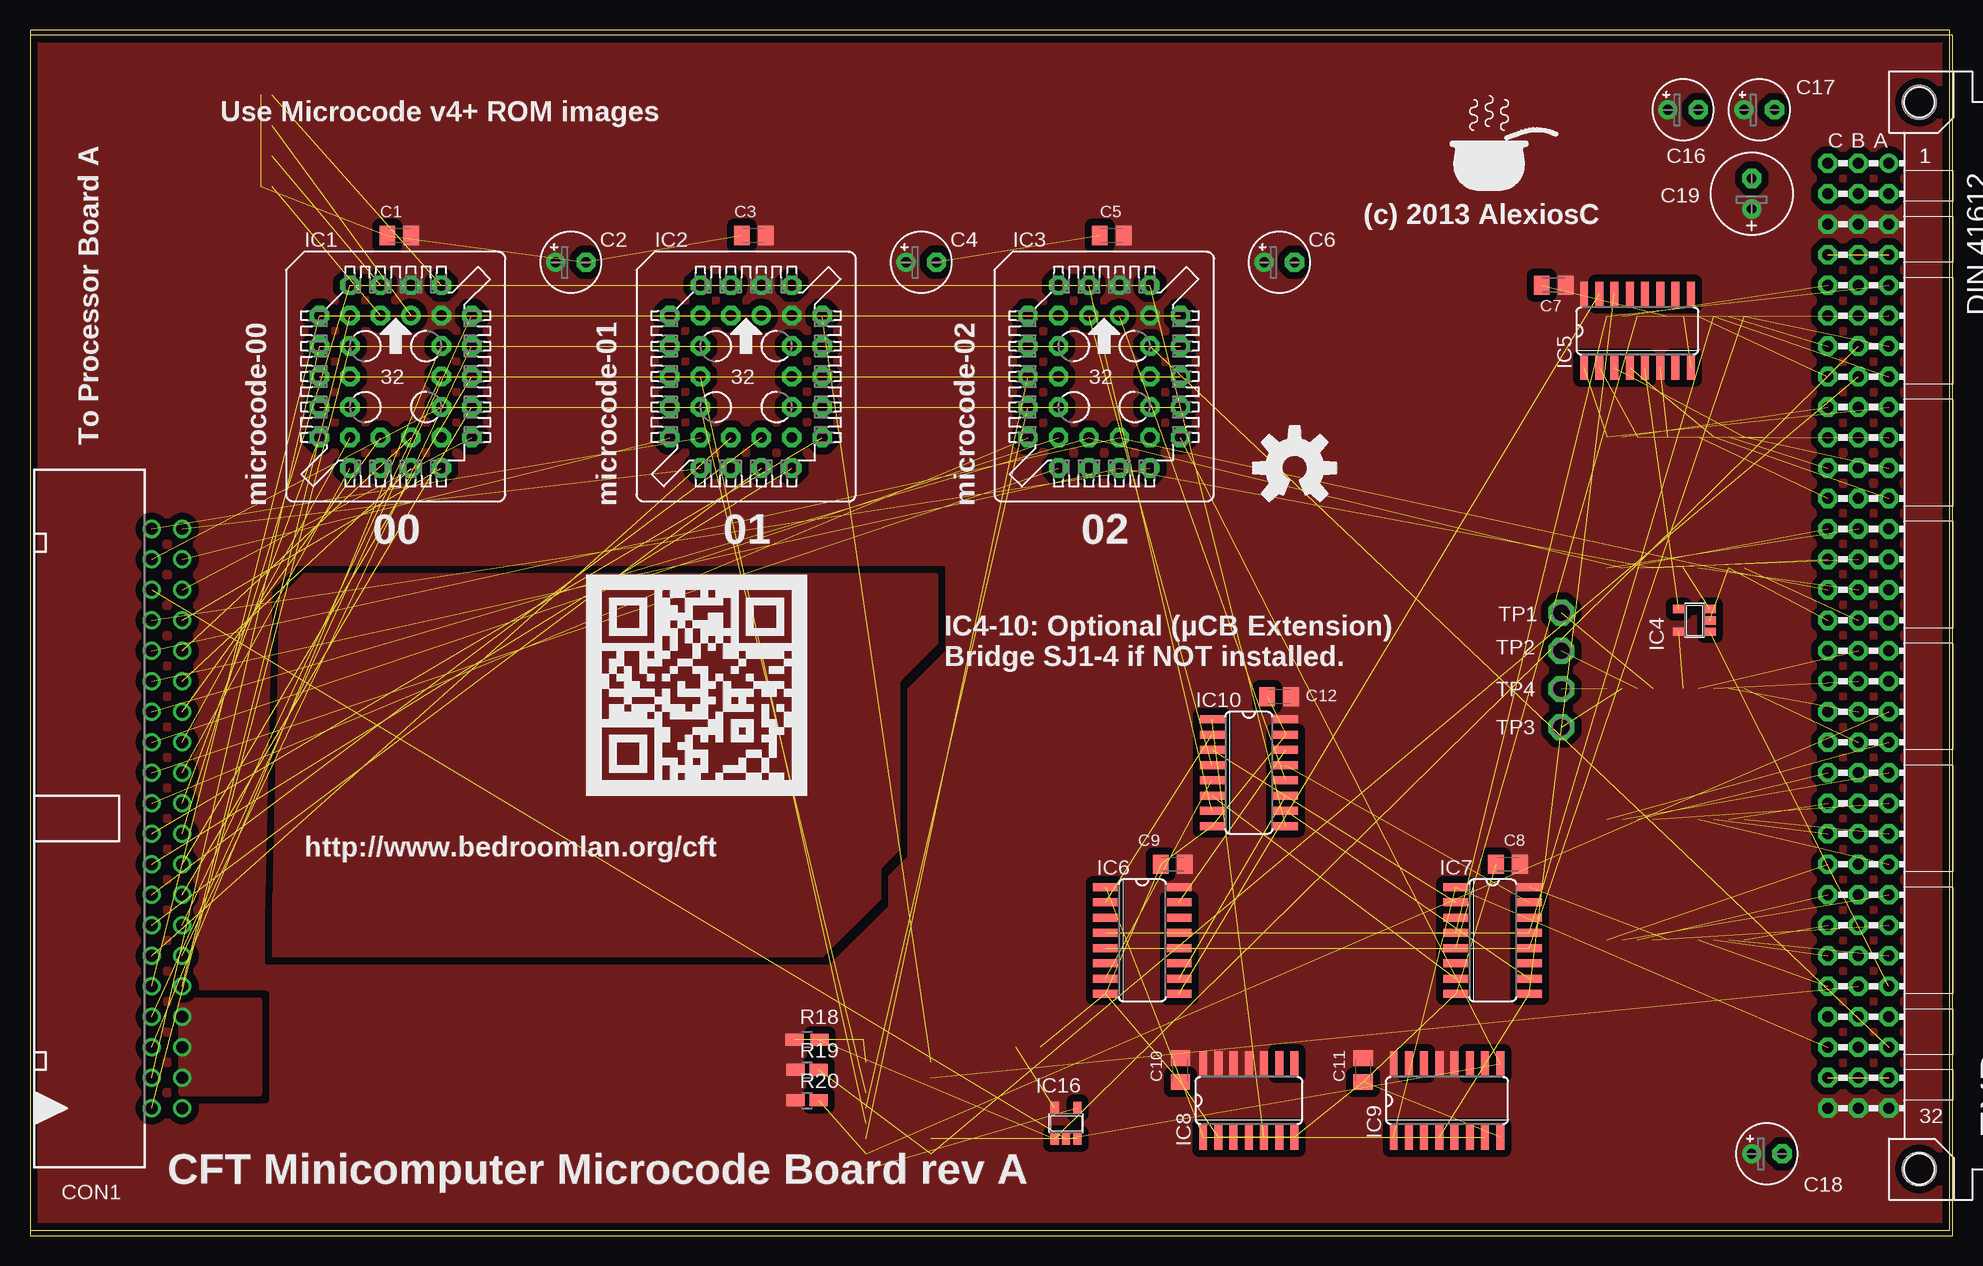
[diagram p5: board, top side]
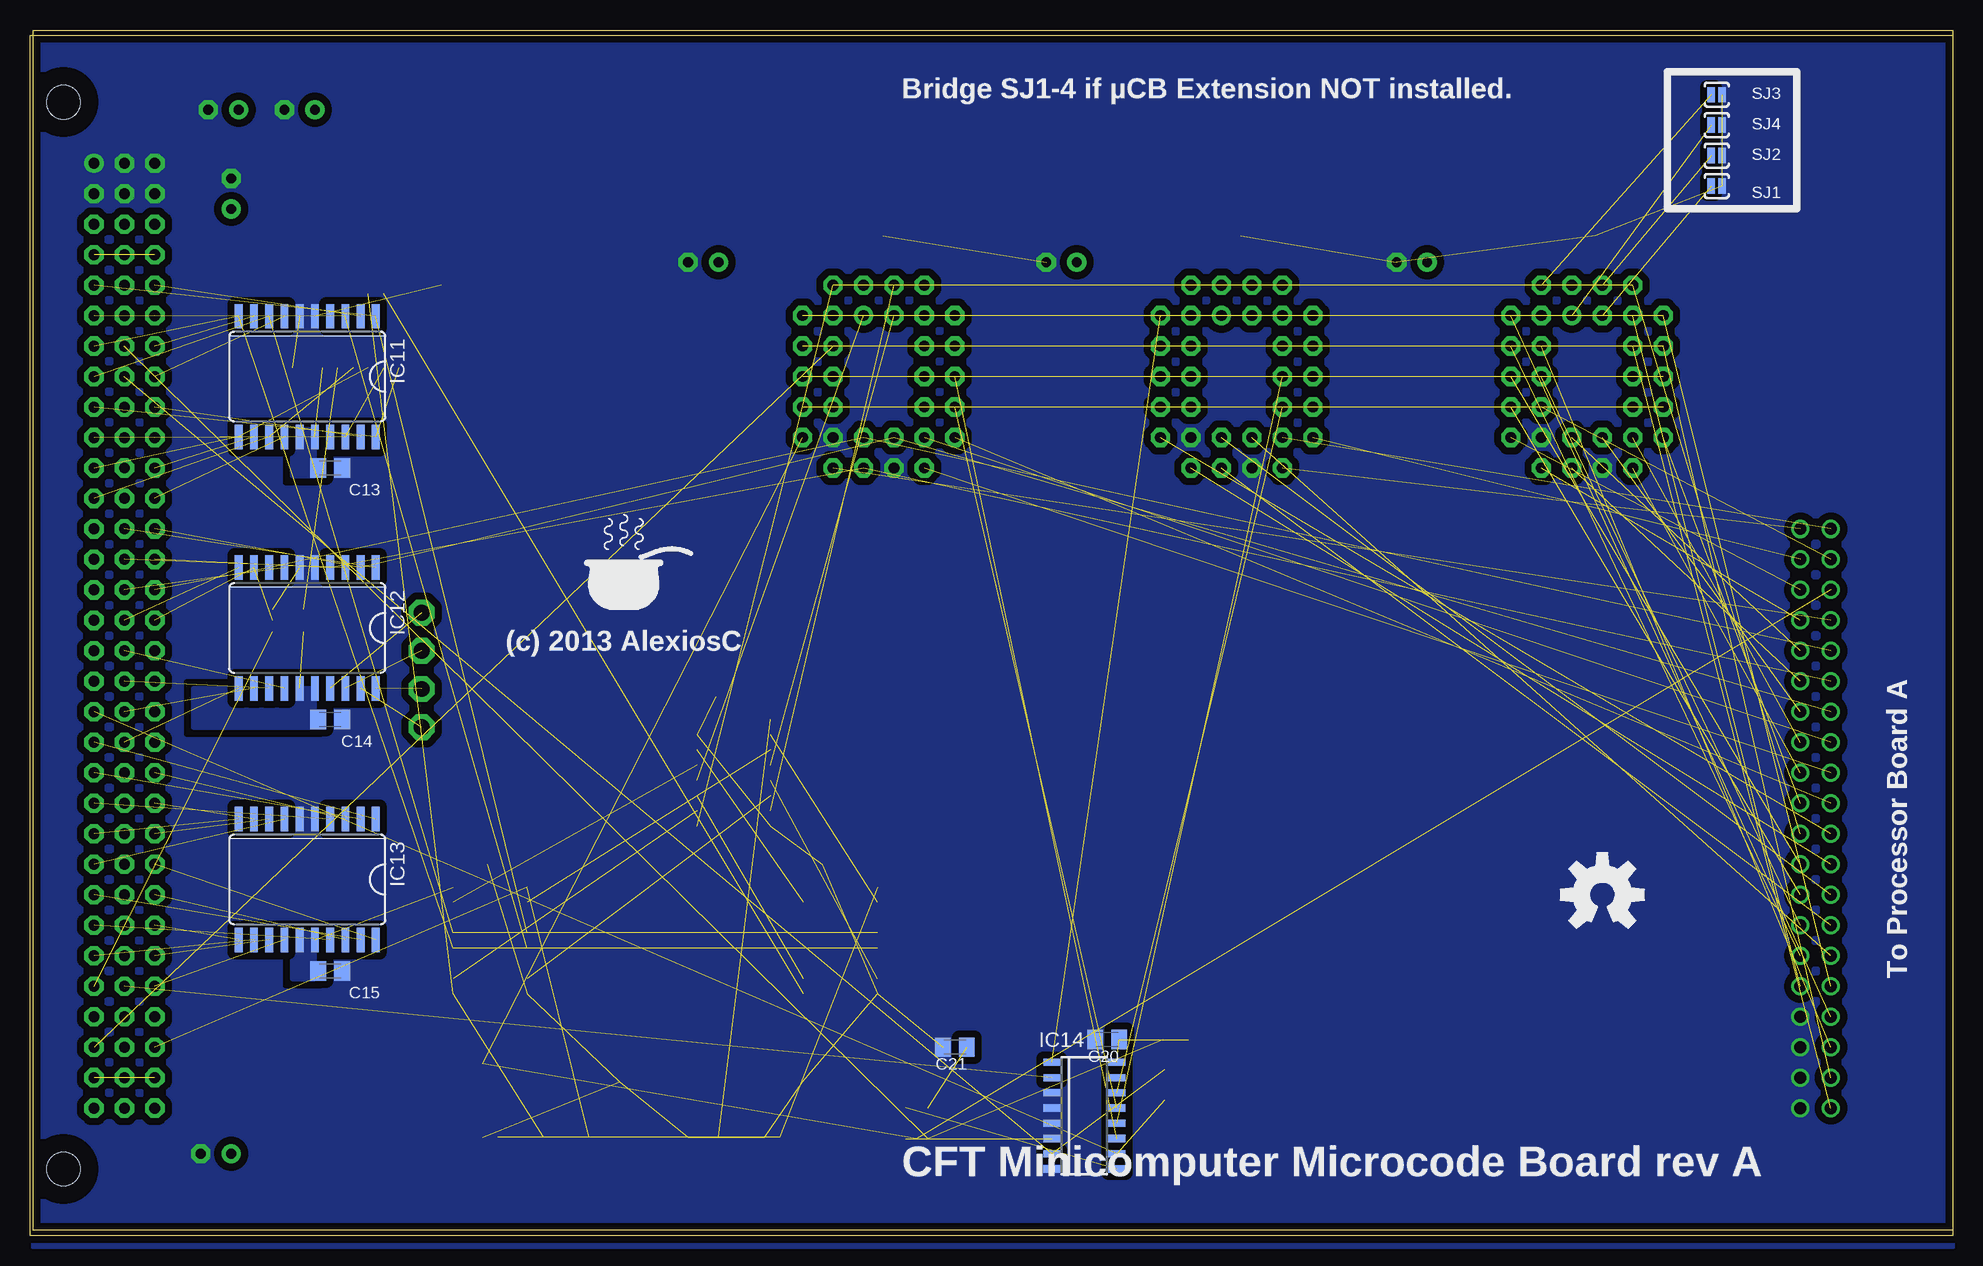
[diagram p6: board, bottom side, seen from below]

Size 160 x 100 mm. Coordinates in mm from the lower left corner, seen from the top.
Outline: 0,0 160,0 160,100 0,100 0,0
Copper layers (1*16): Top 0.035mm / dielectric 1.5mm / Bottom 0.035mm
Design rules "Fusion_eagle_rule_v1.1 *": minimum track width 6mil, minimum drill 12mil, track to track 6mil, track to pad 6mil, pad to pad 6mil, via to via 6mil, smd to smd 0mil, copper to edge 10mil, drill to drill 10mil, minimum pad ring 10mil, minimum via ring 6mil, stop-mask expansion 2mil, vias tented up to drill 100mil, thermal gap 10mil

### Footprints (pad centres in the part's own frame; a part is rotated, then mirrored left to right if it is on the bottom)
C0805K = smd 1.3 x 1.6: 1 -1,0; 2 1,0
E2,5-5 = drill 0.813 pad 1.6 round: + -1.27,0 | drill 0.813 pad 1.6 octagon: - 1.27,0
E2,5-7 = drill 0.813 pad 1.6 round: + -1.27,0 | drill 0.813 pad 1.6 octagon: - 1.27,0
PAK100/2500-5-40 = drill 1 pad 1.422 round: 1 -24.13,-1.27; 2 -24.13,1.27; 3 -21.59,-1.27; 4 -21.59,1.27; 5 -19.05,-1.27; 6 -19.05,1.27; 7 -16.51,-1.27; 8 -16.51,1.27; 9 -13.97,-1.27; 10 -13.97,1.27; 11 -11.43,-1.27; 12 -11.43,1.27; 13 -8.89,-1.27; 14 -8.89,1.27; 15 -6.35,-1.27; 16 -6.35,1.27; 17 -3.81,-1.27; 18 -3.81,1.27; 19 -1.27,-1.27; 20 -1.27,1.27; 21 1.27,-1.27; 22 1.27,1.27; 23 3.81,-1.27; 24 3.81,1.27; 25 6.35,-1.27; 26 6.35,1.27; 27 8.89,-1.27; 28 8.89,1.27; 29 11.43,-1.27; 30 11.43,1.27; 31 13.97,-1.27; 32 13.97,1.27; 33 16.51,-1.27; 34 16.51,1.27; 35 19.05,-1.27; 36 19.05,1.27; 37 21.59,-1.27; 38 21.59,1.27; 39 24.13,-1.27; 40 24.13,1.27
VG96K = drill 0.914 pad 1.6 round: A1 154.94,39.37 | drill 0.914 pad 1.6 octagon: A2 154.94,36.83; A3 154.94,34.29; A4 154.94,31.75; A5 154.94,29.21; A6 154.94,26.67; A7 154.94,24.13; A8 154.94,21.59; A9 154.94,19.05; A10 154.94,16.51; A11 154.94,13.97; A12 154.94,11.43; A13 154.94,8.89; A14 154.94,6.35; A15 154.94,3.81; A16 154.94,1.27; A17 154.94,-1.27; A18 154.94,-3.81; A19 154.94,-6.35; A20 154.94,-8.89; A21 154.94,-11.43; A22 154.94,-13.97; A23 154.94,-16.51; A24 154.94,-19.05; A25 154.94,-21.59; A26 154.94,-24.13; A27 154.94,-26.67; A28 154.94,-29.21; A29 154.94,-31.75; A30 154.94,-34.29; A31 154.94,-36.83; A32 154.94,-39.37; B1 152.4,39.37; B2 152.4,36.83; B3 152.4,34.29; B4 152.4,31.75; B5 152.4,29.21; B6 152.4,26.67; B7 152.4,24.13; B8 152.4,21.59; B9 152.4,19.05; B10 152.4,16.51; B11 152.4,13.97; B12 152.4,11.43; B13 152.4,8.89; B14 152.4,6.35; B15 152.4,3.81; B16 152.4,1.27; B17 152.4,-1.27; B18 152.4,-3.81; B19 152.4,-6.35; B20 152.4,-8.89; B21 152.4,-11.43; B22 152.4,-13.97; B23 152.4,-16.51; B24 152.4,-19.05; B25 152.4,-21.59; B26 152.4,-24.13; B27 152.4,-26.67; B28 152.4,-29.21; B29 152.4,-31.75; B30 152.4,-34.29; B31 152.4,-36.83; B32 152.4,-39.37; C1 149.86,39.37; C2 149.86,36.83; C3 149.86,34.29; C4 149.86,31.75; C5 149.86,29.21; C6 149.86,26.67; C7 149.86,24.13; C8 149.86,21.59; C9 149.86,19.05; C10 149.86,16.51; C11 149.86,13.97; C12 149.86,11.43; C13 149.86,8.89; C14 149.86,6.35; C15 149.86,3.81; C16 149.86,1.27; C17 149.86,-1.27; C18 149.86,-3.81; C19 149.86,-6.35; C20 149.86,-8.89; C21 149.86,-11.43; C22 149.86,-13.97; C23 149.86,-16.51; C24 149.86,-19.05; C25 149.86,-21.59; C26 149.86,-24.13; C27 149.86,-26.67; C28 149.86,-29.21; C29 149.86,-31.75; C30 149.86,-34.29; C31 149.86,-36.83; C32 149.86,-39.37 | hole 2.794: 157.48,44.45; 157.48,-44.45
PLCC32 = drill 0.9 pad 1.6 round: 1 1.27,5.08 | drill 0.9 pad 1.6 octagon: 2 -1.27,7.62; 3 -1.27,5.08; 4 -3.81,7.62; 5 -6.35,5.08; 6 -3.81,5.08; 7 -6.35,2.54; 8 -3.81,2.54; 9 -6.35,0; 10 -3.81,0; 11 -6.35,-2.54; 12 -3.81,-2.54; 13 -6.35,-5.08; 14 -3.81,-7.62; 15 -3.81,-5.08; 16 -1.27,-7.62; 17 -1.27,-5.08; 18 1.27,-7.62; 19 1.27,-5.08; 20 3.81,-7.62; 21 6.35,-5.08; 22 3.81,-5.08; 23 6.35,-2.54; 24 3.81,-2.54; 25 6.35,0; 26 3.81,0; 27 6.35,2.54; 28 3.81,2.54; 29 6.35,5.08; 30 3.81,7.62; 31 3.81,5.08; 32 1.27,7.62
SOT23-5 = smd 0.69 x 0.99: 1 -0.95,-1.29; 2 0,-1.29; 3 0.95,-1.29; 4 0.95,1.3; 5 -0.95,1.3
SO16 = smd 0.66 x 2.032: 1 -4.445,-3.073; 2 -3.175,-3.073; 3 -1.905,-3.073; 4 -0.635,-3.073; 5 0.635,-3.073; 6 1.905,-3.073; 7 3.175,-3.073; 8 4.445,-3.073; 9 4.445,3.073; 10 3.175,3.073; 11 1.905,3.073; 12 0.635,3.073; 13 -0.635,3.073; 14 -1.905,3.073; 15 -3.175,3.073; 16 -4.445,3.073
SO14 = smd 0.66 x 2.032: 1 -3.81,-3.073; 2 -2.54,-3.073; 3 -1.27,-3.073; 4 0,-3.073; 5 1.27,-3.073; 6 2.54,-3.073; 7 3.81,-3.073; 8 3.81,3.073; 9 2.54,3.073; 10 1.27,3.073; 11 0,3.073; 12 -1.27,3.073; 13 -2.54,3.073; 14 -3.81,3.073
SO20W = smd 0.66 x 2.032: 1 -5.715,-5.029; 2 -4.445,-5.029; 3 -3.175,-5.029; 4 -1.905,-5.029; 5 -0.635,-5.029; 6 0.635,-5.029; 7 1.905,-5.029; 8 3.175,-5.029; 9 4.445,-5.029; 10 5.715,-5.029; 11 5.715,5.029; 12 4.445,5.029; 13 3.175,5.029; 14 1.905,5.029; 15 0.635,5.029; 16 -0.635,5.029; 17 -1.905,5.029; 18 -3.175,5.029; 19 -4.445,5.029; 20 -5.715,5.029
SO16D = smd 0.6 x 1.4: 1 -4.445,-2.715; 2 -3.175,-2.715; 3 -1.905,-2.715; 4 -0.635,-2.715; 5 0.635,-2.715; 6 1.905,-2.715; 7 3.175,-2.715; 8 4.445,-2.715; 9 4.445,2.715; 10 3.175,2.715; 11 1.905,2.715; 12 0.635,2.715; 13 -0.635,2.715; 14 -1.905,2.715; 15 -3.175,2.715; 16 -4.445,2.715
R0805W = smd 1.5 x 1: 1 -1.052,0; 2 1.052,0
R0805W' = smd 1.5 x 1: 1 -0.94,0; 2 0.94,0
SJ_2S-NO = smd 0.635 x 1.27: 1 -0.45,0; 2 0.45,0
P1-13 = drill 1.321 pad 2.159 octagon: TP 0,0

### Placement (x,y rotation side)
$4_37_$  113.67,51.44 0 bottom
$4_39_$  29.21,27.94 0 bottom
C1  30.8,82.87 180 top
C2  45.09,80.64 0 top
C3  60.33,82.87 180 top
C4  74.3,80.64 0 top
C5  90.17,82.87 180 top
C6  104.14,80.64 0 top
C7  127,78.74 180 top
C8  123.19,30.48 180 top
C9  95.25,30.48 180 top
C10  95.89,13.34 270 top
C11  111.12,13.34 270 top
C12  104.14,44.45 180 top
C13  135.25,63.5 0 bottom
C14  135.25,42.55 0 bottom
C15  135.25,21.59 0 bottom
C16  137.79,93.34 0 top
C17  144.15,93.34 0 top
C18  144.78,6.35 0 top
C19  143.51,86.36 90 top
C20  70.48,15.88 180 bottom
C21  83.19,15.24 180 bottom
CON1  11.43,34.29 90 top
EXP  0,49.53 0 top
IC1  30.48,71.12 0 top
IC2  59.69,71.12 0 top
IC3  89.53,71.12 0 top
IC4  138.75,50.8 90 top
IC5  133.99,74.93 0 top
IC6  92.71,24.13 270 top
IC7  121.92,24.13 270 top
IC8  101.6,10.79 0 top
IC9  118.11,10.79 0 top
IC10  101.6,38.1 270 top
IC11  137.16,71.12 180 bottom
IC12  137.16,50.16 180 bottom
IC13  137.16,29.21 180 bottom
IC14  72.39,9.53 270 bottom
IC16  86.36,8.89 0 top
R18  64.77,15.88 0 top
R19  4k7  [R0805W']  64.77,13.34 0 top
R20  4k7  [R0805W']  64.77,10.79 0 top
SJ1  19.68,87 180 bottom
SJ2  19.68,89.53 180 bottom
SJ3  19.68,94.61 180 bottom
SJ4  19.68,92.08 180 bottom
TP1  127.64,51.44 0 top
TP2  127.64,48.26 0 top
TP3  127.64,41.91 0 top
TP4  127.64,45.09 0 top
U$1  SIGNATURESILK  [SIGNATURE]  118.75,86.36 0 top
U$2  46.35,36.2 0 top
U$3  OSHW-LOGOL  [OSHW-LOGO-L]  105.41,63.5 0 top

### Tracks (layer width: path | path; a pad name or v marks a point on that pad's centre or on a via)
!AINDEX  (3 unrouted)
!CLI  (1 unrouted)
!CLL  (1 unrouted)
!CPL  (1 unrouted)
!DEC  (1 unrouted)
!END  (3 unrouted)
!ENDEXT  (2 unrouted)
!HALT  (2 unrouted)
!INCPC  (1 unrouted)
!IO  (3 unrouted)
!IRQS  (4 unrouted)
!MEM  (3 unrouted)
!R  (3 unrouted)
!RESET  (4 unrouted)
!RSTHOLD  (4 unrouted)
!SETUCBP  (1 unrouted)
!SETUCBT  (3 unrouted)
!SKIP  (3 unrouted)
!STI  (1 unrouted)
!STPAC  (1 unrouted)
!STPDR  (1 unrouted)
!SYSDEV  (1 unrouted)
!UCBA!/UCBB  (1 unrouted)
!UCE  (3 unrouted)
!UPCCLR  (1 unrouted)
!W  (2 unrouted)
!WEN  (1 unrouted)
!WS  (2 unrouted)
+3.3V  (2 unrouted)
+12V  (2 unrouted)
AB0  (3 unrouted)
AB1  (3 unrouted)
AB2  (3 unrouted)
AB3  (3 unrouted)
AB4  (2 unrouted)
AB5  (2 unrouted)
AB6  (2 unrouted)
AB7  (2 unrouted)
AB8  (1 unrouted)
AB9  (1 unrouted)
AB10  (1 unrouted)
AB11  (1 unrouted)
AB12  (1 unrouted)
AB13  (1 unrouted)
AB14  (1 unrouted)
AB15  (1 unrouted)
AEXT0  (1 unrouted)
AEXT1  (1 unrouted)
AEXT2  (1 unrouted)
AEXT3  (1 unrouted)
AEXT4  (1 unrouted)
AEXT5  (1 unrouted)
AEXT6  (1 unrouted)
AEXT7  (1 unrouted)
CLK4  (1 unrouted)
DB0  (1 unrouted)
DB1  (1 unrouted)
DB2  (1 unrouted)
DB3  (1 unrouted)
DB4  (1 unrouted)
DB5  (1 unrouted)
DB6  (1 unrouted)
DB7  (1 unrouted)
DB8  (1 unrouted)
DB9  (1 unrouted)
DB10  (1 unrouted)
DB11  (1 unrouted)
DB12  (1 unrouted)
DB13  (1 unrouted)
DB14  (1 unrouted)
DB15  (1 unrouted)
FL  (3 unrouted)
FV  (3 unrouted)
GND  (23 unrouted)
  pour Bottom (isolate 0.61, rank 6, no thermals): 0,100.33 160.02,100.33 160.02,-1.27 0,-1.27
  pour Top (isolate 0.61, no thermals): 20.32,25.4 20.32,22.86 66.04,22.86 70.8,27.62 70.8,30.16 72.39,31.75 72.39,45.72 75.56,48.9 75.56,54.61 22.86,54.61 20.95,52.7
  pour Top (isolate 0.61, no thermals): 12.7,19.05 12.7,11.43 19.05,11.43 19.05,19.05
IR11  (3 unrouted)
IR12  (3 unrouted)
IR13  (3 unrouted)
IR14  (3 unrouted)
IR15  (3 unrouted)
N$11  (1 unrouted)
N$12  (1 unrouted)
N$13  (1 unrouted)
OPIF0  (1 unrouted)
OPIF1  (1 unrouted)
OPIF2  (1 unrouted)
OPIF3  (1 unrouted)
RUNIT0  (1 unrouted)
RUNIT1  (1 unrouted)
RUNIT2  (1 unrouted)
RUNIT3  (1 unrouted)
TERM0  (1 unrouted)
TERM1  (1 unrouted)
TERM2  (1 unrouted)
TERM3  (1 unrouted)
UCB0  (4 unrouted)
UCB1  (4 unrouted)
UCB2  (4 unrouted)
UCB3  (4 unrouted)
UCBA0  (1 unrouted)
UCBA1  (1 unrouted)
UCBA2  (1 unrouted)
UCBA3  (1 unrouted)
UCBB0  (1 unrouted)
UCBB1  (1 unrouted)
UCBB2  (1 unrouted)
UCBB3  (1 unrouted)
UPC0  (3 unrouted)
UPC1  (3 unrouted)
UPC2  (3 unrouted)
UPC3  (3 unrouted)
VCC  (6 unrouted)
  pour Bottom (isolate 0.61, rank 2, no thermals): 136.53,66.67 138.43,66.67 138.43,62.87 136.53,62.87
  pour Bottom (isolate 0.61, rank 2, no thermals): 136.53,24.77 138.43,24.77 138.43,20.95 136.53,20.95
  pour Bottom (isolate 0.61, rank 2, no thermals): 136.53,45.09 146.69,45.09 146.69,41.91 136.53,41.91
  pour Top (isolate 0.61, no thermals): 94.93,14.92 98.11,14.92 98.11,13.34 94.93,13.34
  pour Top (isolate 0.61, no thermals): 110.81,14.92 113.98,14.92 113.98,13.34 110.17,13.34
  pour Top (isolate 0.61, no thermals): 126.68,79.06 129.86,79.06 129.86,77.47 126.68,77.47
  pour Top (isolate 0.61, no thermals): 126.05,31.43 126.05,28.26 124.46,28.26 124.46,31.43
  pour Top (isolate 0.61, no thermals): 96.84,31.43 96.84,28.26 95.25,28.26 95.25,31.43
  pour Top (isolate 0.61, no thermals): 105.73,44.77 105.73,42.23 104.14,42.23 104.14,44.77
  pour Top (isolate 0.61, rank 6, no thermals): 0,99.69 0,-0.64 160.66,-0.64 160.66,99.69
WUNIT0  (1 unrouted)
WUNIT1  (1 unrouted)
WUNIT2  (1 unrouted)

### Text on the board
tNames: Use Microcode v4+ ROM images | (c) 2013 AlexiosC | To Processor Board A | microcode-00 | microcode-01 | microcode-02 | 00 | 01 | 02 | IC4-10: Optional (µCB Extension) | Bridge SJ1-4 if NOT installed. | http://www.bedroomlan.org/cft | CFT Minicomputer Microcode Board rev A
bNames: Bridge SJ1-4 if µCB Extension NOT installed. | (c) 2013 AlexiosC | To Processor Board A | CFT Minicomputer Microcode Board rev A